# EAGLE design bat_mini1 (EAGLE 8.7.1)
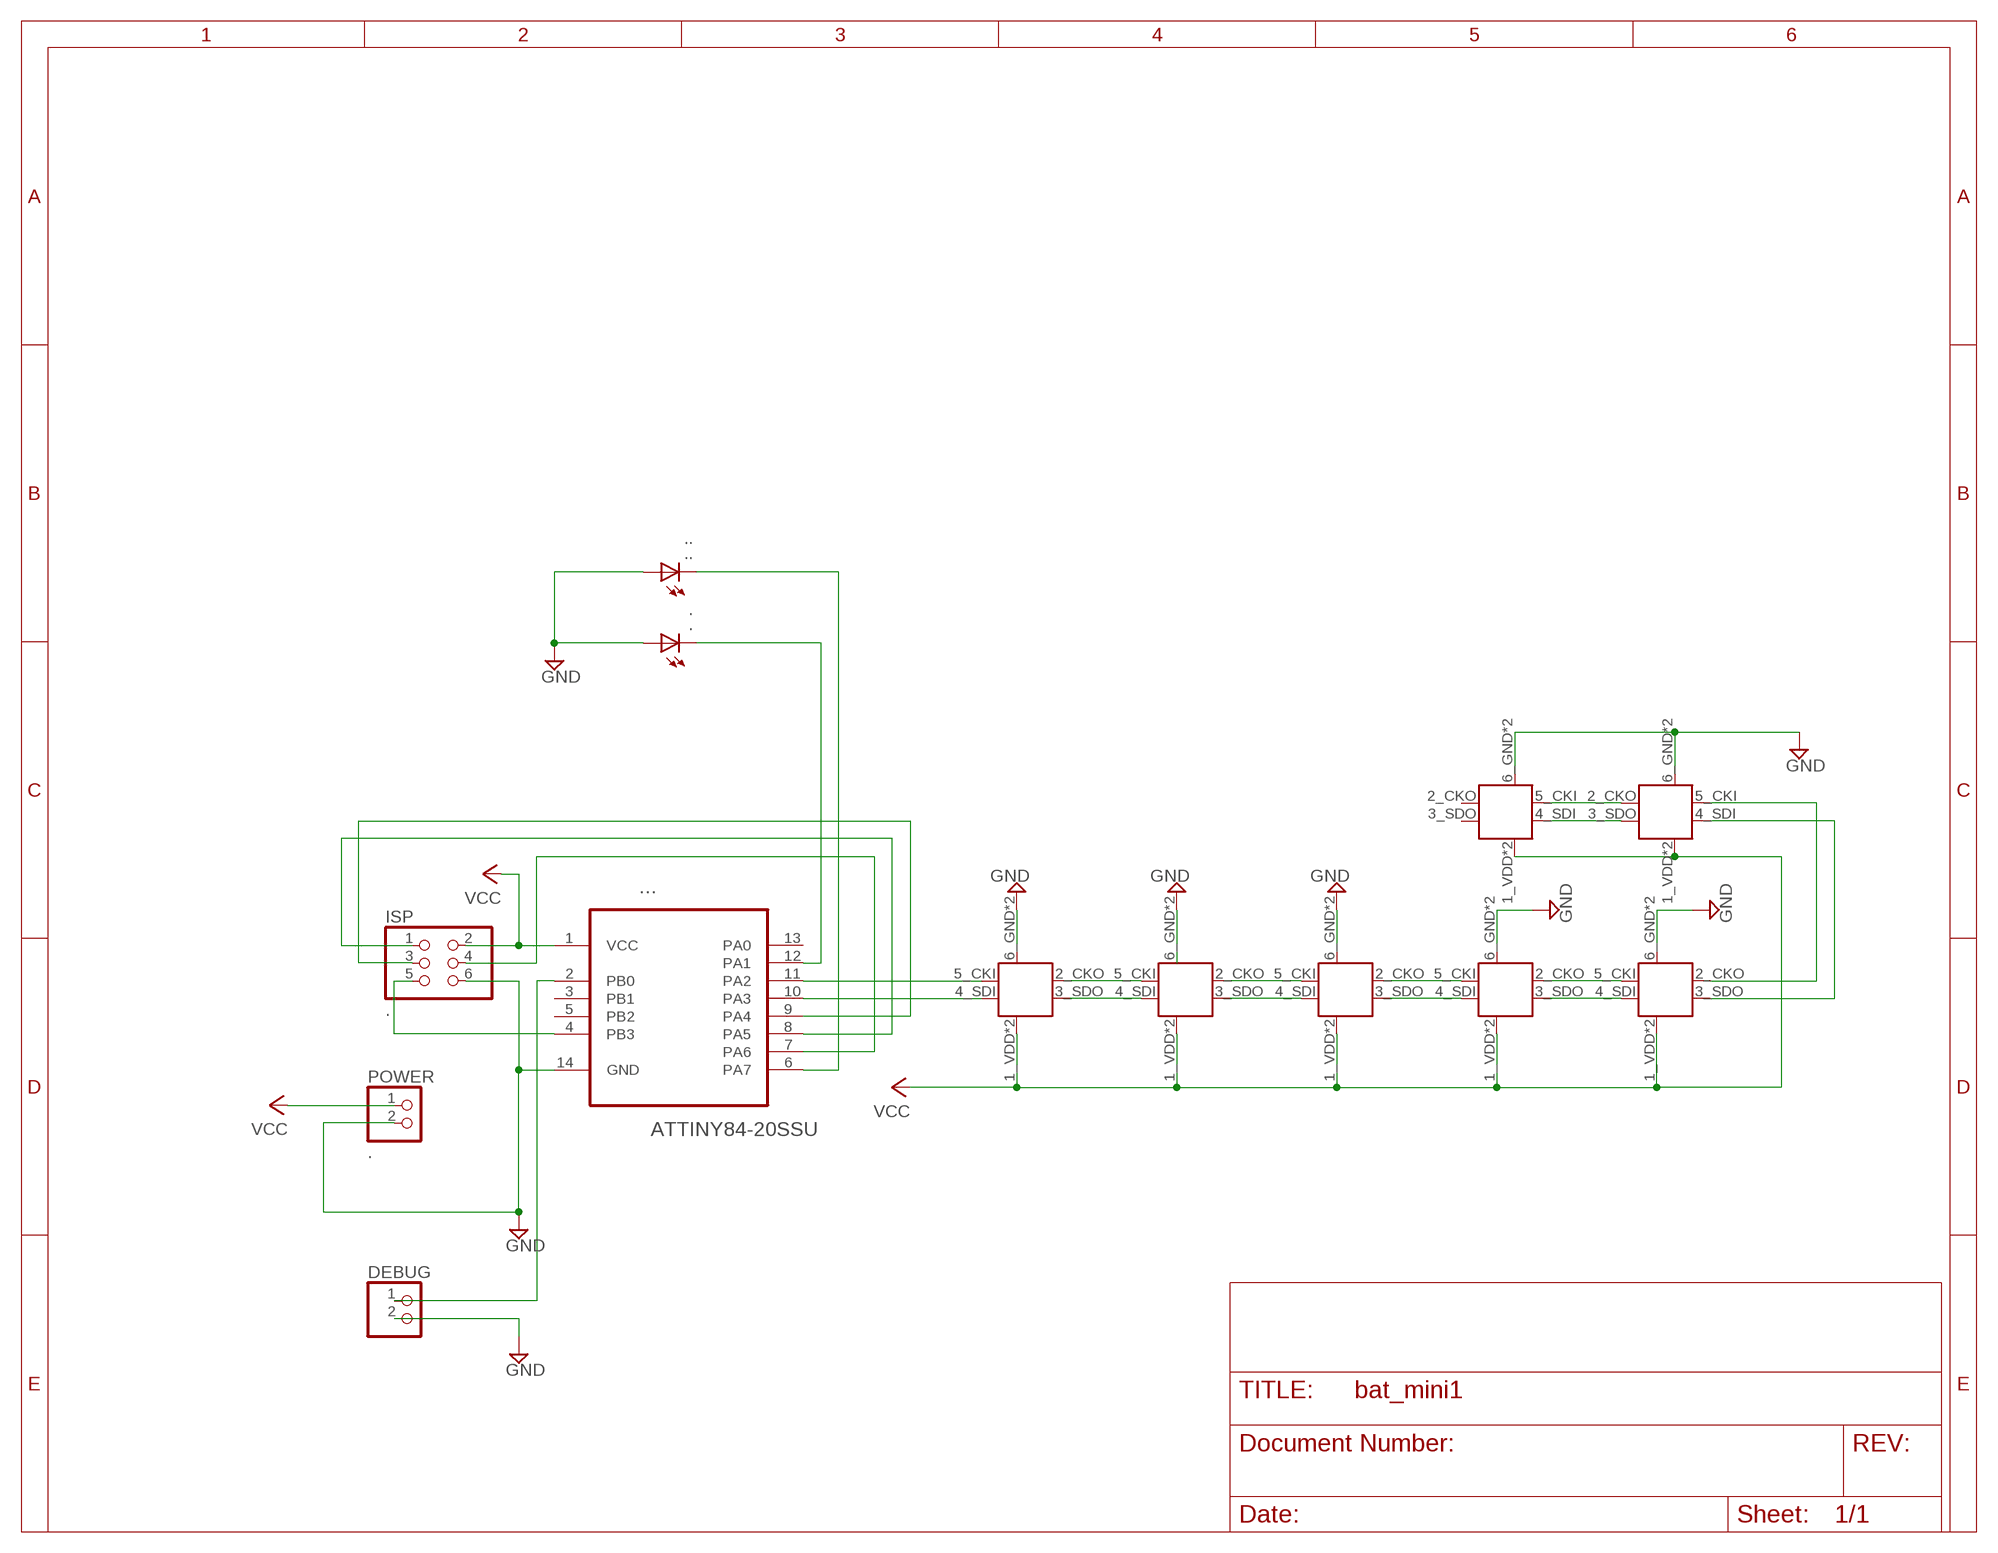
[diagram p0: schematic, sheet 1]

## Parts
.  .  LEDCHIP-LED0805  [CHIP-LED0805]
..  ..  LEDCHIP-LED0805  [CHIP-LED0805]
...  ATTINY84-20SSU  [SOIC127P600X175-14N]
DEBUG  PINHD-1X2  [1X02]
EYE1  APA102  [APA102-2020]
EYE2  APA102  [APA102-2020]
ISP  .  PINHD-2X3  [2X03]
POWER  .  PINHD-1X2  [1X02]
U$4  APA102  [APA102-2020]
U$5  APA102  [APA102-2020]
U$6  APA102  [APA102-2020]
U$7  APA102  [APA102-2020]
U$8  APA102  [APA102-2020]

## Nets
GND: ....14(GND) ...A ..A DEBUG.2 EYE1.6_GND(GND) EYE1.GNDPAD(GND) ISP.6 POWER.2 U$5.6_GND(GND) U$5.GNDPAD(GND) U$6.6_GND(GND) U$6.GNDPAD(GND) U$8.6_GND(GND) U$8.GNDPAD(GND)
N$1: ....2(PB0) DEBUG.1
N$3: ....8(PA5) ISP.1
N$4: ....7(PA6) ISP.4
N$5: ....9(PA4) ISP.3
N$6: ....4(PB3) ISP.5
N$7: ....12(PA1) ..C
N$8: ....6(PA7) ...C
N$9: ....11(PA2) EYE1.5_CKI(CKI)
N$10: ....10(PA3) EYE1.4_SDI(SDI)
N$11: EYE1.3_SDO(SDO) EYE2.4_SDI(SDI)
N$12: EYE1.2_CKO(CKO) EYE2.5_CKI(CKI)
N$13: EYE2.3_SDO(SDO) U$4.4_SDI(SDI)
N$14: EYE2.2_CKO(CKO) U$4.5_CKI(CKI)
N$16: U$4.3_SDO(SDO) U$5.4_SDI(SDI)
N$17: U$4.2_CKO(CKO) U$5.5_CKI(CKI)
N$18: U$5.3_SDO(SDO) U$6.4_SDI(SDI)
N$19: U$5.2_CKO(CKO) U$6.5_CKI(CKI)
N$20: U$6.2_CKO(CKO) U$7.5_CKI(CKI)
N$21: U$6.3_SDO(SDO) U$7.4_SDI(SDI)
N$22: U$7.3_SDO(SDO) U$8.4_SDI(SDI)
N$23: U$7.2_CKO(CKO) U$8.5_CKI(CKI)
VCC: ....1(VCC) EYE1.1_VDD(VCC) EYE1.VDDPAD(VCC) EYE2.1_VDD(VCC) EYE2.VDDPAD(VCC) ISP.2 POWER.1 U$4.1_VDD(VCC) U$4.VDDPAD(VCC) U$5.1_VDD(VCC) U$5.VDDPAD(VCC) U$6.1_VDD(VCC) U$6.VDDPAD(VCC) U$7.1_VDD(VCC) U$7.VDDPAD(VCC) U$8.1_VDD(VCC) U$8.VDDPAD(VCC)
Unconnected: ....3(PB1) ....5(PB2) ....13(PA0) U$8.2_CKO(CKO) U$8.3_SDO(SDO)

## Power pins joined to a net without a drawn wire
GND: EYE2.6_GND(GND) EYE2.GNDPAD(GND) U$4.6_GND(GND) U$4.GNDPAD(GND) U$7.6_GND(GND) U$7.GNDPAD(GND)

## Library data of the parts
. .. = led:LED: LED OSRAM: - CHIPLED LG R971, LG N971, LY N971, LG Q971, LY Q971, LO R971, LY R971 LH N974, LH R974 LS Q976, LO Q976, LY Q976 LO Q996 - Hyper CHIPLED LW Q18S LB Q993, LB Q99A, LB R99A - SideLED LS A670, LO A670, LY A670, LG A670, LP A670 LB A673, LV A673, LT A673, LW A673 LH A674 LY A675 LS A676, LA A676, LO A676, LY A676, LW A676 LS A679, LY A679, LG A679 - Hyper Micro SIDELED® LS Y876, LA Y876, LO Y876, LY Y876 LT Y87S - SmartLED LW L88C, LW L88S LB L89C, LB L89S, LG L890 LS L89K, LO L89K, LY L89K LS L896, LA L896, LO L896, LY L896 - TOPLED LS T670, LO T670, LY T670, LG T670, LP T670 LSG T670, LSP T670, LSY T670, LOP T670, LYG T670 LG T671, LOG T671, LSG T671 LB T673, LV T673, LT T673, LW T673 LH T674 LS T676, LA T676, LO T676, LY T676, LB T676, LH T676, LSB T676, LW T676 LB T67C, LV T67C, LT T67C, LS T67K, LO T67K, LY T67K, LW E67C LS E67B, LA E67B, LO E67B, LY E67B, LB E67C, LV E67C, LT E67C LW T67C LS T679, LY T679, LG T679 LS T770, LO T770, LY T770, LG T770, LP T770 LB T773, LV T773, LT T773, LW T773 LH T774 LS E675, LA E675, LY E675, LS T675 LS T776, LA T776, LO T776, LY T776, LB T776 LHGB T686 LT T68C, LB T68C - Hyper Mini TOPLED® LB M676 - Mini TOPLED Santana® LG M470 LS M47K, LO M47K, LY M47K Source: http://www.osram.convergy.de LUXEON: - LUMILED® LXK2-PW12-R00, LXK2-PW12-S00, LXK2-PW14-U00, LXK2-PW14-V00 LXK2-PM12-R00, LXK2-PM12-S00, LXK2-PM14-U00 LXK2-PE12-Q00, LXK2-PE12-R00, LXK2-PE12-S00, LXK2-PE14-T00, LXK2-PE14-U00 LXK2-PB12-K00, LXK2-PB12-L00, LXK2-PB12-M00, LXK2-PB14-N00, LXK2-PB14-P00, LXK2-PB14-Q00 LXK2-PR12-L00, LXK2-PR12-M00, LXK2-PR14-Q00, LXK2-PR14-R00 LXK2-PD12-Q00, LXK2-PD12-R00, LXK2-PD12-S00 LXK2-PH12-R00, LXK2-PH12-S00 LXK2-PL12-P00, LXK2-PL12-Q00, LXK2-PL12-R00 Source: www.luxeon.com KINGBRIGHT: KA-3528ASYC Source: www.kingbright.com
... = Atmel_By_element14_Batch_1-00:ATTINY84-20SSU: 8-bit Microcontroller with Bytes In-System Programmable Flash; OC_FARNELL: 1636955; OC_NEWARK: 03P2040; PACKAGE: SOIC-14; SUPPLIER: Atmel
DEBUG POWER = pinhead:PINHD-1X2: PIN HEADER
EYE1 EYE2 U$4-U$8 = pimoroni-optoelectronics:APA102
ISP = pinhead:PINHD-2X3: PIN HEADER

## Board
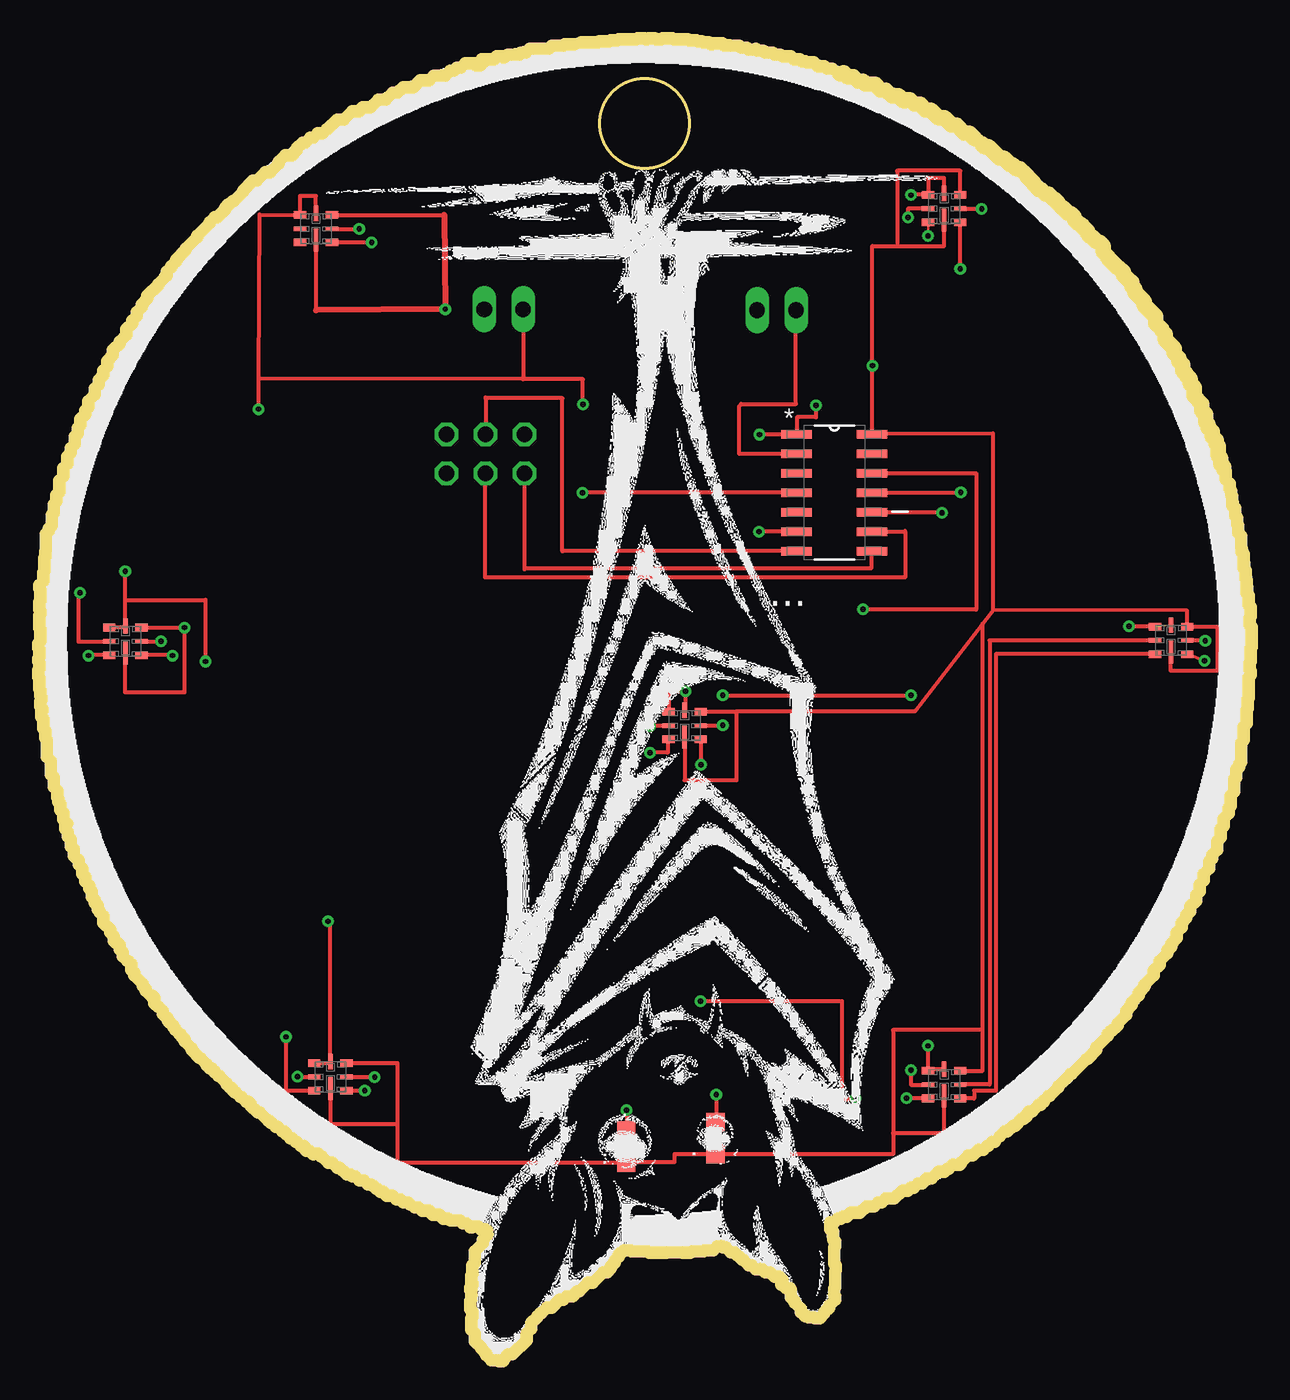
[diagram p1: board, top side]
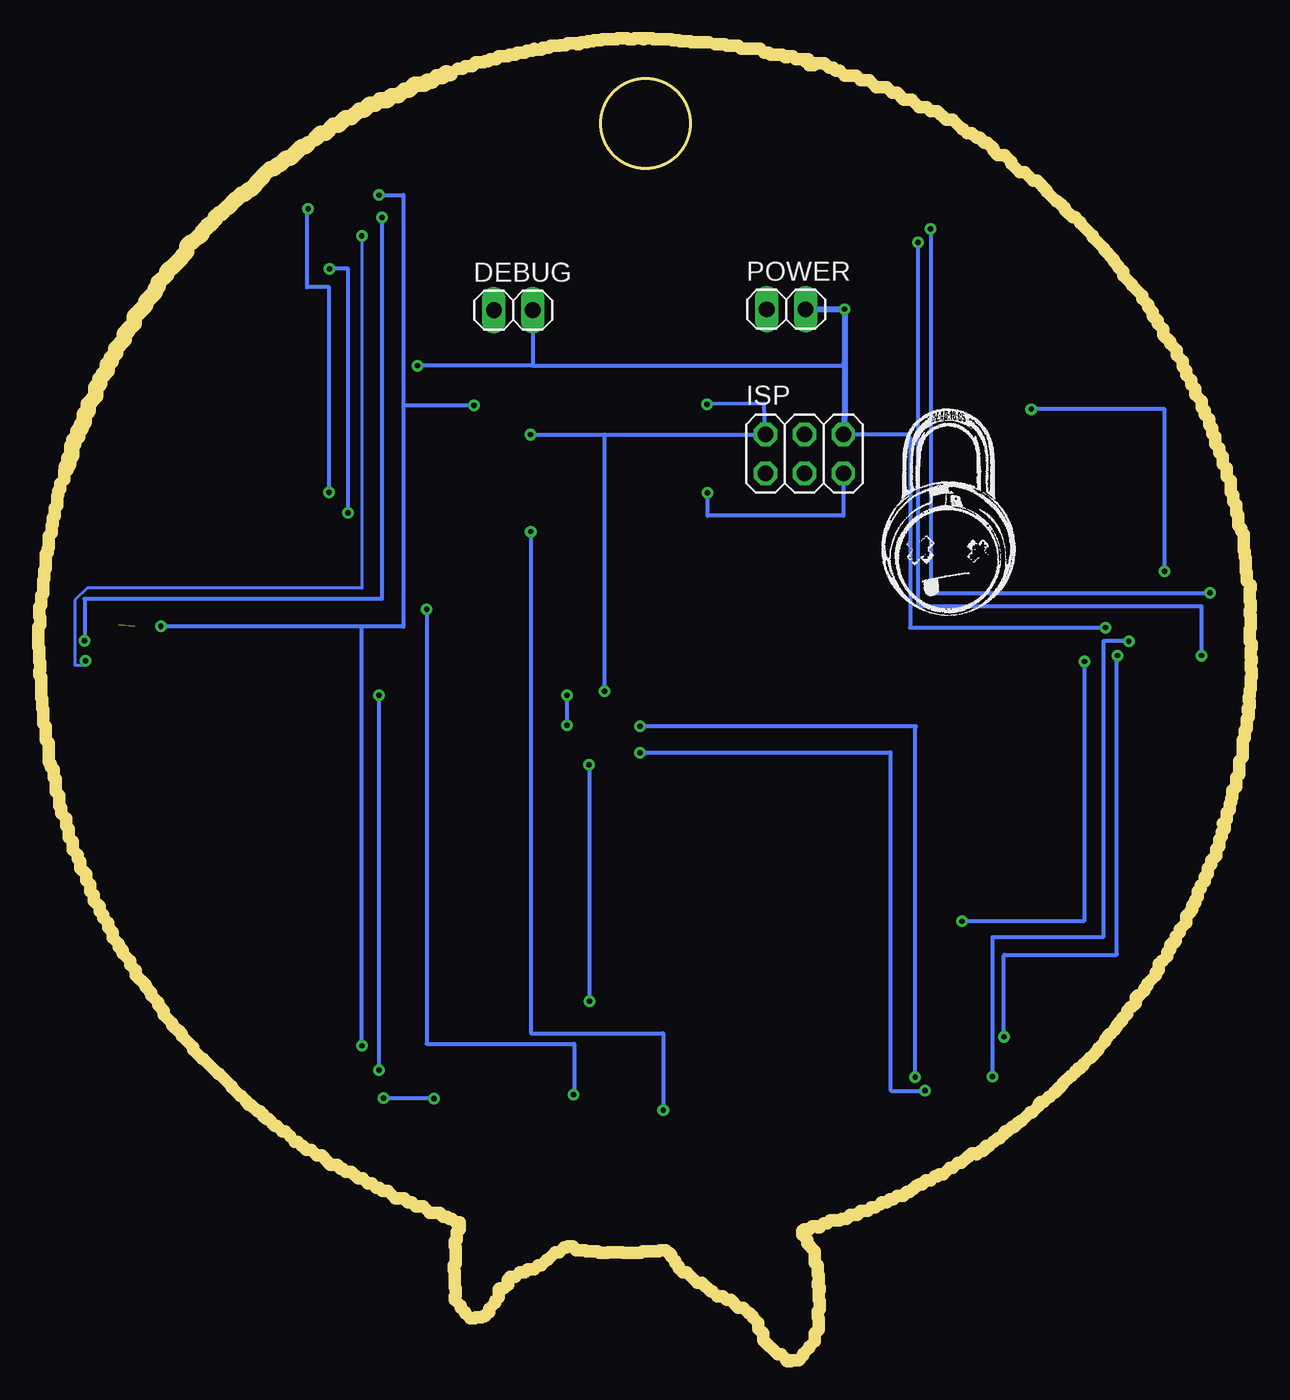
[diagram p2: board, bottom side, seen from below]

Size 79.19 x 86.38 mm. Coordinates in mm from the lower left corner, seen from the top.
Outline: 52.31,84.06 52.5,84.06 52.56,84.13 52.81,83.88 53.19,83.88 53.5,83.56 53.81,83.56 54,83.38 54.63,83.38 55,83 55.31,83 55.69,82.63 56.13,82.63 56.44,82.31 56.63,82.31 56.69,82.38 56.88,82.38 57.19,82.06 57.56,82.06 57.94,81.69 58.25,81.69 58.75,81.19 59.13,81.19 59.63,80.69 59.94,80.69 60.44,80.19 60.75,80.19 61.13,79.81
Outline: 61.56,79.5 61.75,79.31 62,79.31 62.75,78.56 63,78.56 63.44,78.13 63.56,78.13 63.81,77.88 64.06,77.88 64.5,77.44 64.5,77.38 65,76.88 65,76.81 65.31,76.5 65.44,76.5 65.75,76.19 65.94,76.19 66.25,75.88 66.31,75.88 66.56,75.63 66.56,75.56 66.81,75.31 66.88,75.31 67.25,74.94 67.38,74.94 67.63,74.69 67.63,74.56 67.94,74.25 68,74.25 68.19,74.06 68.19,74 68.25,74 68.5,73.75 68.5,73.63 68.69,73.44 68.75,73.44 69.13,73.06 69.25,73.06 69.5,72.81 69.5,72.44 69.81,72.13 69.81,72.06 70.5,71.38 70.56,71.38 70.81,71.13 70.81,70.94 71.31,70.44 71.38,70.44 71.38,70.19 71.56,70 71.56,69.81 72.19,69.19 72.19,68.94 72.94,68.19 72.94,67.75 73.31,67.38 73.31,67.31 73.56,67.06 73.56,66.69 74.13,66.13 74.13,65.81 74.44,65.5 74.44,65.31 74.69,65.06 74.69,64.69 74.94,64.44 74.94,64.38 75.19,64.13 75.19,63.81 75.44,63.56 75.44,63 75.94,62.5 75.94,62.06 76.19,61.81 76.19,61.31 76.38,61.13 76.38,60.94 76.63,60.69 76.63,60.37 76.88,60.12 76.88,59.87 77,59.75 77,59.12 77.19,58.94 77.19,58.56 77.38,58.37 77.38,58.25 77.5,58.12 77.5,57.56 77.75,57.31 77.75,56.94 77.88,56.81 77.88,56.56 77.94,56.5 77.94,55.87 78.13,55.69 78.13,55.19 78.25,55.06 78.25,54.62 78.31,54.56 78.31,54.06 78.5,53.87 78.5,53.12 78.56,53.06 78.56,52.81 78.69,52.69 78.69,51.75 78.81,51.62 78.81,51.06 78.88,51 78.88,50.12 79,50 79,49.37 79.13,49.25 79.13,48.62 79.06,48.56 79.06,48.06 79.19,47.94 79.19,46.62 79.13,46.56 79.13,45.69 79.06,45.62 79.06,45.12 79.13,45.06 79.13,44.81 79,44.69 79,43.31 78.94,43.25 78.94,42.62 78.88,42.56 78.88,41.62 78.69,41.44 78.69,40.56 78.5,40.37 78.5,39.12 78.38,39 78.38,38.81 78.19,38.62 78.19,38.12 78.06,38 78.06,37.19 77.81,36.94 77.81,36.25 77.69,36.12 77.69,35.75 77.38,35.44 77.38,34.94 77.19,34.75 77.19,34.19 76.94,33.94 76.94,33.37 76.63,33.06 76.63,32.81 76.44,32.62 76.44,32.19 76.06,31.81 76.06,31.37 75.81,31.12 75.81,30.69 75.56,30.44 75.56,30.06 75.19,29.69 75.19,29.37 74.94,29.12 74.94,28.94 74.63,28.62 74.63,28.31 74.31,28 74.31,27.62 73.94,27.25 73.94,27.06 73.69,26.81 73.69,26.62 73.19,26.12 73.19,25.87 72.81,25.5 72.81,25.19 72.19,24.56 72.19,24.44 71.81,24.06 71.81,23.87 71.38,23.44 71.38,23.25 71,22.87 71,22.62 70.44,22.06 70.44,21.94 70.06,21.56 70,21.56 69.81,21.37 69.81,21.25 69.06,20.5 69.06,20.31 68.5,19.75 68.44,19.75 67.44,18.75 67.38,18.75 66.56,17.94 66.56,17.87 66,17.31 65.94,17.31 65.63,17 65.63,16.94 65.44,16.75 65.31,16.75 64.88,16.31 64.69,16.31 64.5,16.12 64.5,16 64.31,15.81 64.19,15.81 63.75,15.37 63.63,15.37 63.25,15 63.06,15 62.75,14.69
Outline: 51.81,84.38 51.5,84.38 51.31,84.56 50.88,84.56 50.63,84.81 50.13,84.81 50.06,84.88 49.81,84.88 49.69,85 49.31,85 49.13,85.19 48.56,85.19 48.44,85.31 48.06,85.31 47.94,85.44 47.44,85.44 47.31,85.56 46.94,85.56 46.81,85.69 46.75,85.63 46.38,85.63 46.25,85.75 45.88,85.75 45.75,85.88 45.19,85.88 45.13,85.94 44.75,85.94 44.63,86.06 44.06,86.06 44,86 43.88,86 43.75,86.13 43.38,86.13 43.31,86.19 43,86.19 42.94,86.25 42.44,86.25 42.38,86.31 41.44,86.31 41.38,86.38 40.75,86.38 40.69,86.31 40.31,86.31 40.25,86.38 39.81,86.38 39.75,86.31 39.63,86.31 39.56,86.38 39.13,86.38 39.06,86.31 37.88,86.31 37.81,86.25 37.38,86.25 37.31,86.19 36.63,86.19 36.56,86.13 35.44,86.13
Outline: 62.44,14.31 62.25,14.31 62,14.06 61.94,14.06 61.69,13.81 61.38,13.81 61,13.44 60.69,13.44 60.25,13 60.25,12.94 60.13,12.81 59.69,12.81 59.44,12.56 59.31,12.56 59.13,12.38 58.75,12.38 58.31,11.94 58,11.94 57.69,11.63 57.44,11.63 57.13,11.31 56.94,11.31 56.75,11.13 56.38,11.13 55.88,10.63 55.31,10.63 55.06,10.38 54.81,10.38 54.56,10.13 54.06,10.13 53.63,9.69 53,9.69 52.75,9.44 52.5,9.44 52.38,9.31 52.19,9.31 51.94,9.06 51.69,9.06 51.69,8.63 51.88,8.44 51.88,7.94 52,7.81 52,7.5 51.94,7.44 51.94,6.38 52.06,6.25 52.06,5.94 52,5.88 52,4.81 51.94,4.75 51.94,4.31 52,4.25 52,4 51.63,3.63 51.63,3.5 51.31,3.19 51.31,3.13 51,2.81 50.69,2.81 50.63,2.88 50.25,2.88 50.19,2.94 50.06,2.94 49.81,3.19 49.75,3.19 49.75,3.44 49.38,3.81 49.38,3.94 49.13,4.19 49.13,4.69 49.06,4.75 48.81,4.75 48.56,5 48.5,5 48.5,5.06 48.56,5.13 48.56,5.31 48.38,5.5 48.06,5.5 47.75,5.81 47.44,5.81 47.25,6 46.81,6 46.56,6.25 46.38,6.25 46,6.63 45.94,6.63 45.44,7.13 45.19,7.13 44.88,7.44 44.69,7.44 44.63,7.5 44.31,7.5 44.06,7.25 43.5,7.25 43.44,7.19 42.69,7.19 42.56,7.06 42.06,7.06 42,7.13 41.06,7.13 41,7.06 39.88,7.06 39.75,7.19 38.69,7.19 38.63,7.25 38.25,7.25 38.06,7.06 38,7.06 37.88,6.94 37.88,6.81 37.63,6.56 37.63,6.44 37.38,6.19 37.38,6.06 37.13,5.81 36.88,5.81 36.19,5.13 35.88,5.13 35.31,4.56 35.19,4.56 34.88,4.25 34.5,4.25 34.25,4 34,4 33.5,3.5 33.19,3.5 32.81,3.13 32.75,3.13 32.56,2.94 32.56,2.88 32.19,2.5 32.19,2.13 31.88,1.81 31.88,1.38 30.94,0.44 30.69,0.44 30.38,0.12 30.38,0.06 30.31,0 30.06,0 30,0.06 29.56,0.06 29.25,0.37 29.25,0.5 28.88,0.88 28.88,0.94 28.5,1.31 28.5,1.81 28.25,2.06 28.25,2.81 28.31,2.88 28.31,3.25 28.19,3.38 28.19,3.94 28.25,4 28.25,4.56 28.19,4.63 28.19,4.81 28.31,4.94 28.31,5.13 28.25,5.19 28.25,5.63 28.31,5.69 28.31,6.25 28.5,6.44 28.5,7.19 29,7.69 29,7.94 29.31,8.25 29.31,8.5 29.19,8.63 28.88,8.63 28.69,8.81 28.38,8.81 28.31,8.75 28.19,8.75 27.94,9 27.69,9 27.5,9.19 26.88,9.19 26.75,9.31 26.44,9.31 26.19,9.56 25.75,9.56 25.5,9.81 25.06,9.81 24.81,10.06 24.56,10.06
Outline: 24.25,10.25 24.13,10.38 23.81,10.38 23.63,10.56 23.38,10.56 23.13,10.81 22.75,10.81 22.5,11.06 22.31,11.06 22.13,11.25 22.06,11.25 21.88,11.44 21.81,11.44 21.69,11.56 21.5,11.56 21.25,11.81 20.94,11.81 20.69,12.06 20.5,12.06 20.38,12.19 20.13,12.19 19.69,12.62 19.5,12.62 19.19,12.94 18.94,12.94 18.5,13.37 18.44,13.37 18.25,13.56 18,13.56 17.94,13.5 17.69,13.75 17.5,13.75 17.38,13.87 17.38,14 17.31,14.06 17.13,14.06 16.88,14.31 16.81,14.31 16.56,14.56 16.44,14.56 16.19,14.81 16.19,14.87 16.06,15 15.94,15 15.63,15.31 15.5,15.31 15.25,15.56 15.19,15.56 15.06,15.69 15,15.69 14.44,16.25 14.31,16.25 13.88,16.69 13.88,16.81 13.75,16.94 13.56,16.94 13.25,17.25 13.19,17.25 12.88,17.56 12.81,17.56 12.69,17.69 12.69,17.75 12.56,17.87 12.5,17.87 12.31,18.06 12.31,18.12 11.81,18.62 11.75,18.62 11.5,18.87 11.5,18.94 11.31,19.12 11.19,19.12 11,19.31 11,19.37 10.56,19.81 10.5,19.81 10,20.31 10,20.44 9.56,20.87 9.56,21 9.38,21.19 9.38,21.25 9.25,21.37 9.19,21.37 8.94,21.62 8.94,21.69 8.81,21.81 8.81,21.94 8.63,22.12 8.56,22.12 8.44,22.25 8.44,22.37 8.13,22.69 8.13,22.87 7.88,23.12 7.81,23.12 7.56,23.37 7.56,23.75 7.44,23.87 7.44,23.75 7,24.19 7,24.31 6.81,24.5 6.81,24.62 6.25,25.19 6.25,25.37 6.06,25.56 6.06,25.94 5.88,26.12 5.81,26.12 5.5,26.44 5.5,26.69 5.31,26.87 5.31,27.19 5.19,27.31 5.06,27.31 4.94,27.44 4.94,27.75 4.69,28 4.69,28.19 4.25,28.62 4.25,29.06 4,29.31 4,29.37 3.88,29.5 3.88,29.75 3.69,29.94 3.69,30.12 3.5,30.31 3.5,30.69 3.31,30.87 3.31,31.06 3.06,31.31 3.06,31.62 2.88,31.81 2.88,32.19 2.63,32.44 2.63,32.69 2.31,33 2.31,33.44 2.13,33.62 2.13,34.06 1.94,34.25 1.94,34.56 1.75,34.75 1.75,35 1.88,35.12 1.63,35.37 1.63,35.81 1.44,36 1.44,36.37 1.31,36.5 1.31,36.75 1.25,36.81 1.25,37.25 1,37.5 1,38.12 0.81,38.31 0.81,39.19 0.56,39.44 0.56,40.56 0.44,40.69 0.44,41.19 0.31,41.31 0.31,41.94 0.19,42.06 0.19,42.37 0.25,42.44 0.25,42.62 0.13,42.75 0.13,43.06 0.19,43.12 0.19,43.37 0.13,43.44 0.13,43.81 0.06,43.87 0.06,44.62 0,44.69 0,45.12 0.06,45.19 0.06,45.62 0,45.69 0,45.87 0.06,45.94 0.06,46.5 0,46.56 0,46.87 0.13,47 0.13,47.81 0.06,47.87 0.06,48.69 0.13,48.75 0.13,49 0.06,49.06 0.06,49.56 0.13,49.62 0.13,50.37 0.06,50.44 0.06,50.69 0.31,50.94 0.31,51.5 0.38,51.56 0.38,52.44 0.44,52.5 0.44,52.87 0.5,52.94 0.5,54 0.69,54.19 0.69,54.37 0.88,54.56 0.88,55.25 1,55.37 1,55.94 1.19,56.12 1.19,56.56 1.38,56.75 1.38,57.5 1.63,57.75 1.63,58.31 1.88,58.56 1.88,59.06 2.13,59.31 2.13,59.62 2.38,59.87 2.38,60.37 2.56,60.56 2.56,60.94 2.75,61.13 2.75,61.5 3.06,61.81 3.06,62.06 3.25,62.25 3.25,62.69 3.69,63.13 3.69,63.5 3.94,63.75 3.94,64.06 4.25,64.38 4.25,64.69 4.5,64.94 4.5,65.31 4.88,65.69 4.88,66 5.31,66.44 5.31,66.56 5.75,67 5.75,67.38 6.13,67.75 6.13,67.94 6.44,68.25 6.44,68.5 6.75,68.81 6.75,69 7.13,69.38 7.13,69.56 7.81,70.25 7.81,70.31 8.38,70.88 8.38,71.13 8.69,71.44 8.69,71.5 9,71.81 9,71.94 9.63,72.56 9.63,72.63 10.38,73.38 10.38,73.5 11.19,74.31 11.19,74.38 11.5,74.69 11.69,74.69 12.19,75.19 12.19,75.31 12.38,75.5 12.44,75.5 12.69,75.75 12.75,75.75 13.38,76.38 13.38,76.44 14,77.06 14.25,77.06 14.81,77.63 15.13,77.63 15.69,78.19 15.69,78.31 16.13,78.75 16.56,78.75 16.88,79.06 16.88,79.19 17.25,79.56 17.44,79.56 17.75,79.88 17.94,79.88 18.25,80.19 18.56,80.19 18.81,80.44 18.88,80.44 19.5,81.06 19.94,81.06 20.5,81.63 20.94,81.63 21.19,81.88 21.69,81.88 22.19,82.38 22.69,82.38 23.13,82.81 23.44,82.81 23.81,83.19 24.5,83.19 24.94,83.63 25.5,83.63 25.81,83.94 26.56,83.94 26.88,84.25 27.13,84.25 27.31,84.44 27.56,84.44 27.88,84.75 28.44,84.75 28.56,84.63 28.88,84.63 29.06,84.81 29.06,84.88 28.94,85 29.75,85 29.94,85.19 30.25,85.19 30.31,85.13 30.44,85.13 30.63,85.31 31.38,85.31 31.5,85.44 31.81,85.44 32.06,85.69 33.31,85.69 33.5,85.88 34.25,85.88 34.38,86 35,86
Outline: circle at 39.56,80.81 radius 2.91
Copper layers (1*16): Top 0.035mm / dielectric 1.5mm / Bottom 0.035mm
Design rules "default": minimum track width 6mil, minimum drill 0.35mm, track to track 6mil, track to pad 6mil, pad to pad 6mil, via to via 6mil, smd to smd 6mil, copper to edge 40mil, drill to drill 6mil, minimum pad ring 10mil, minimum via ring 8mil, stop-mask expansion 4mil, vias tented up to drill 0mil, thermal gap 10mil

### Footprints (pad centres in the part's own frame; a part is rotated, then mirrored left to right if it is on the bottom)
CHIP-LED0805 = smd 1.2 x 1.2: A 0,-1.05; C 0,1.05
SOIC127P600X175-14N = smd 1.981 x 0.559: 1 -2.464,3.81; 2 -2.464,2.54; 3 -2.464,1.27; 4 -2.464,0; 5 -2.464,-1.27; 6 -2.464,-2.54; 7 -2.464,-3.81; 8 2.464,-3.81; 9 2.464,-2.54; 10 2.464,-1.27; 11 2.464,0; 12 2.464,1.27; 13 2.464,2.54; 14 2.464,3.81
1X02 = drill 1.016 long: 1 -1.27,0; 2 1.27,0
APA102-2020 = smd 0.8 x 0.5: 1_VDD -1.05,0.9; 3_SDO -1.05,-0.9; 4_SDI 1.05,-0.9; 6_GND 1.05,0.9 | smd 0.8 x 0.3: 2_CKO -1.05,0; 5_CKI 1.05,0 | smd 0.3 x 1.5: GNDPAD 0,-0.75 | smd 0.3 x 1: VDDPAD 0,1
2X03 = drill 1.016 octagon: 1 -2.54,-1.27; 2 -2.54,1.27; 3 0,-1.27; 4 0,1.27; 5 2.54,-1.27; 6 2.54,1.27

### Placement (x,y rotation side)
.  44.19,14.56 0 top
..  38.38,14 0 top
...  51.96,56.7 0 top
DEBUG  48.19,68.62 0 bottom
EYE1  59.12,75.25 0 top
EYE2  73.94,47.06 0 top
ISP  29.19,59.25 0 bottom
POWER  30.38,68.69 0 bottom
U$4  59.12,18.06 0 top
U$5  42.19,41.5 0 top
U$6  19.06,18.56 0 top
U$7  5.69,47 0 top
U$8  18.12,73.94 0 top

### Tracks (layer width: path | path; a pad name or v marks a point on that pad's centre or on a via)
GND  (via drill 0.35)
  Top 0.254: 18.13,68.63 U$8.GNDPAD | U$8.6_GND 26.47,74.84 | 56.05,72.81 54.44,72.81 v54.44,65 54.42,64.99 ....14 54.42,60.54 62.32,60.57 62.32,49.03 | 56.05,72.81 59.13,72.81 EYE1.GNDPAD | EYE1.6_GND 60.17,77.73 56.05,77.73 56.05,72.81 | EYE2.GNDPAD 73.92,46.31 73.92,45.07 76.94,45.07 76.94,47.96 EYE2.6_GND 74.99,49 62.32,49.03 | U$5.GNDPAD 42.19,37.95 45.58,37.95 45.58,42.4 | 45.58,42.4 45.65,42.4 | 45.58,42.4 U$5.6_GND | 62.32,49.03 61.65,48.16 | 61.65,48.16 57.22,42.43 45.58,42.43 45.58,42.4 | ..A 41.52,13.51 41.52,12.99 38.38,12.99 ...A 23.45,12.95 23.45,15.49 | U$4.6_GND 61.64,18.96 61.64,21.63 | 61.64,21.63 55.79,21.63 55.79,14.9 | 55.79,14.9 59.13,14.9 U$4.GNDPAD | 55.79,14.9 55.79,13.51 ..A | ..A | 61.64,21.63 61.64,48.16 61.65,48.16 | 23.45,15.49 23.45,19.46 U$6.6_GND | U$6.GNDPAD 19.06,15.49 23.45,15.49 | U$7.6_GND v9.54,47.9 9.54,43.67 5.67,43.67 5.67,46.25 U$7.GNDPAD
  Top 0.406: 26.47,74.84 26.5,74.81 v26.56,68.69 18.13,68.63
  Bottom 0.254: DEBUG.2 46.92,65.02 | 46.92,65.02 46.94,65 26.75,65 26.56,65.19 | v54.44,65 54.42,65.02 46.92,65.02 | ISP.6 22.52,60.52 22.28,60.27 22.28,47.89 v9.55,47.89 v9.54,47.9
  Bottom 0.406: POWER.2 v26.56,68.69 26.56,65.19 26.56,61.87 ISP.6
N$1
  Top 0.254: ....2 45.76,59.24 45.75,59.25 45.75,62.38 45.88,62.5 49.44,62.5 49.44,68.6 DEBUG.1
N$3
  Top 0.254: ....8 54.36,52.89 54.36,51.76 31.74,51.76 | 31.74,51.76 31.74,51.69 | 31.74,51.76 ISP.1
N$4
  Top 0.254: ....7 34.21,52.89 34.21,62.88 29.2,62.88 | 29.2,62.88 29.2,62.94 | 29.2,62.88 ISP.4
N$5
  Top 0.254: ....9 56.57,54.16 | 56.57,54.16 56.57,54.23 | 56.57,54.16 56.57,51.18 29.17,51.18 29.17,57.98 ISP.3
N$6  (via drill 0.35)
  Top 0.254: ....4 v35.51,56.7
  Bottom 0.254: v35.51,56.7 35.51,55.2 26.65,55.2 ISP.5
N$7  (via drill 0.35)
  Top 0.254: ....12 61.22,57.97 61.22,49.06 53.84,49.06 v53.84,49.09 | v44.25,17.41 44.25,15.61 ..C
  Bottom 0.254: v53.84,49.09 53.84,20.72 44.22,20.72 44.22,17.41 v44.25,17.41
N$8  (via drill 0.35)
  Top 0.254: ....6 v47.05,54.16 | v38.4,16.4 38.4,15.05 ...C
  Bottom 0.254: v47.05,54.16 47.05,21.4 38.4,21.4 v38.4,16.4
N$9  (via drill 0.35)
  Top 0.254: ....11 60.21,56.7 v60.21,56.73 | v61.57,75.22 60.17,75.22 EYE1.5_CKI
  Bottom 0.254: v60.21,56.73 60.21,70.12 61.64,70.12 61.64,75.22 v61.57,75.22
N$10  (via drill 0.35)
  Top 0.254: ....10 58.97,55.43 v58.97,55.4 | v60.17,71.32 EYE1.4_SDI
  Bottom 0.254: v58.97,55.4 58.97,71.32 v60.17,71.32 60.21,71.32
N$11  (via drill 0.35)
  Top 0.152: EYE1.3_SDO v58.08,73.47 v58.07,73.47
  Top 0.203: v76.11,45.73 EYE2.4_SDI
  Bottom 0.203: v58.07,73.47 58.07,50.47 76.01,50.47 76.8,49.68 76.8,46.79 76.79,46.78 76.79,45.45 76.11,45.45 v76.11,45.73
N$12  (via drill 0.35)
  Top 0.254: EYE1.2_CKO 56.76,75.25 v56.76,74.67 | v76.17,47.05 74.99,47.05 EYE2.5_CKI
  Bottom 0.254: v56.76,74.67 56.76,49.78 76.17,49.78 v76.17,47.05
N$13
  Top 0.254: EYE2.3_SDO 62.5,46.16 62.5,17.66 61.08,17.66 61.08,17.15 60.17,17.15 U$4.4_SDI
N$14
  Top 0.254: EYE2.2_CKO 62.09,47.06 62.09,18.06 U$4.5_CKI
N$16  (via drill 0.35)
  Top 0.254: U$5.4_SDI v43.24,38.95 | v43.21,23.52 52.44,23.52 52.44,17.12 53.35,17.12 v53.35,17.15 | v56.67,17.18 58.08,17.18 U$4.3_SDO
  Bottom 0.254: v43.24,38.95 43.24,23.52 v43.21,23.52 | v53.35,17.15 56.67,17.15 v56.67,17.18
N$17  (via drill 0.35)
  Top 0.254: U$5.5_CKI 44.66,41.5 44.67,41.49 v44.67,41.52 | v56.96,19 56.96,18.06 U$4.2_CKO | v44.67,43.47 v56.96,43.47
  Bottom 0.254: v44.67,41.52 v44.67,43.47 | v56.96,43.47 v56.96,19
N$18  (via drill 0.35)
  Top 0.254: U$5.3_SDO 41.1,40.56 41.1,39.77 41.06,39.73 v39.93,39.73 | v21.31,17.67 U$6.4_SDI
  Bottom 0.254: v39.93,39.73 23.61,39.73 23.58,39.77 23.58,17.73 23.52,17.67 v21.31,17.67
N$19  (via drill 0.35)
  Top 0.254: U$6.5_CKI 21.94,18.56 v21.95,18.55 | v39.93,41.46 39.97,41.5 U$5.2_CKO
  Bottom 0.254: v21.95,18.55 21.95,41.39 21.89,41.46 v39.93,41.46
N$20  (via drill 0.35)
  Top 0.254: U$7.5_CKI 8,47 v8.01,47.01 | v16.92,18.58 16.93,18.56 U$6.2_CKO
  Bottom 0.254: v8.01,47.01 9.64,47.01 9.67,46.98 9.67,27.71 9.7,27.68 16.92,27.68 v16.92,18.58
N$21  (via drill 0.35)
  Top 0.254: U$6.3_SDO 16.2,17.66 16.17,17.64 v16.17,21.18 | v8.76,46.07 8.73,46.1 U$7.4_SDI
  Bottom 0.254: v16.17,21.18 16.17,26.51 16.14,26.54 8.83,26.54 8.79,26.57 8.79,46.04 v8.76,46.07
N$22  (via drill 0.35)
  Top 0.254: U$7.3_SDO 3.27,46.1 v3.27,46.07 | v21.76,73.05 19.17,73.05 U$8.4_SDI
  Bottom 0.254: v3.27,46.07 3.27,49.29 21.76,49.29 v21.76,73.05
N$23  (via drill 0.35)
  Top 0.254: U$8.5_CKI 19.17,73.93 v20.95,73.93 | v2.71,50.17 2.62,50.17 2.62,47 | 2.62,46.98 2.62,47 | 2.62,47 U$7.2_CKO
  Bottom 0.254: v20.95,73.93 20.95,50.17 v2.71,50.17
VCC  (via drill 0.35)  (1 unrouted)
  Top 0.254: v47.06,60.5 47.08,60.51 ....1 49.52,60.51 49.52,61.64 50.75,61.64 v50.75,62.42 | EYE1.VDDPAD 59.13,77.25 58.06,77.25 58.08,77.24 EYE1.1_VDD 56.96,76.15 v56.96,76.13 | v35.54,62.49 35.54,64.11 31.64,64.12 | 31.64,64.12 14.38,64.14 | 14.38,64.14 14.45,74.87 U$8.1_VDD 17.08,76.07 18.12,76.07 U$8.VDDPAD | POWER.1 31.64,64.12 | U$5.VDDPAD 42.23,42.5 v42.23,43.73 41.14,43.73 U$5.1_VDD | v71.19,47.99 72.89,47.99 EYE2.1_VDD | U$4.VDDPAD 58.08,19.06 U$4.1_VDD 58.08,20.58 v58.06,20.59 | U$7.1_VDD 5.69,47.9 U$7.VDDPAD 5.69,49.71 | U$6.1_VDD 19.06,19.46 U$6.VDDPAD 19.06,28.55 v18.9,28.72 | 5.69,49.71 5.69,51.57 v5.67,51.57 | v14.38,62.16 14.38,64.14 | 5.69,49.71 10.91,49.71 v10.91,45.68
  Bottom 0.254: v47.06,60.5 42.23,60.5 | 42.23,60.5 31.75,60.5 ISP.2 31.8,62.52 v35.54,62.49 | 42.23,60.5 v42.23,43.73 | v56.96,76.13 55.36,76.13 55.36,62.42 | 55.36,62.42 v50.75,62.42 | 55.36,62.42 55.36,47.96 58.06,47.96 | v71.19,47.99 71.19,47.96 58.06,47.96 | v5.67,51.57 5.67,62.16 v14.38,62.16 | v10.91,45.68 10.91,28.78 10.97,28.72 v18.9,28.72 | v58.06,20.59 58.06,47.96